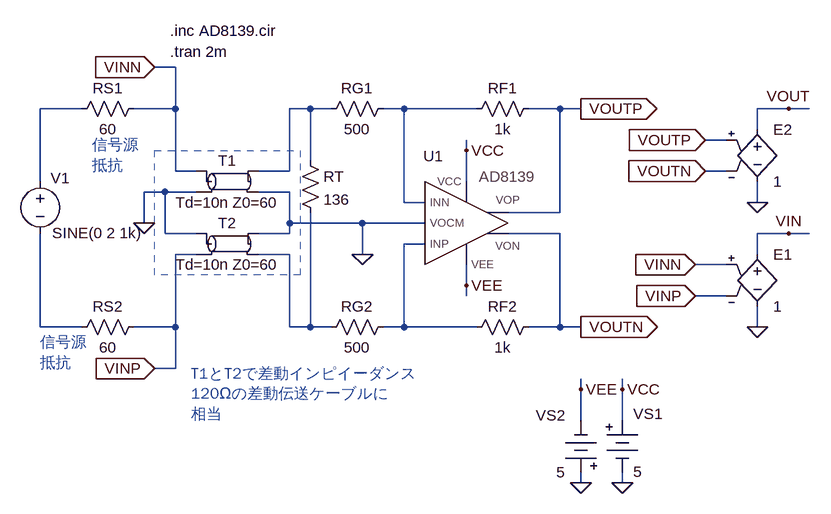
[diagram p0: schematic fig-02-05-16.asc]
fig-02-05-16.asc, the LTspice schematic file:
Version 4
SHEET 1 1332 680
WIRE -192 -192 -224 -192
WIRE -336 -128 -400 -128
WIRE -192 -128 -192 -192
WIRE -192 -128 -256 -128
WIRE 16 -128 -16 -128
WIRE 48 -128 16 -128
WIRE 160 -128 128 -128
WIRE 272 -128 160 -128
WIRE 400 -128 352 -128
WIRE 432 -128 400 -128
WIRE 752 -128 704 -128
WIRE 784 -128 752 -128
WIRE 704 -96 704 -128
WIRE 656 -80 624 -80
WIRE 256 -64 256 -80
WIRE 16 -48 16 -128
WIRE -192 -32 -192 -128
WIRE -160 -32 -192 -32
WIRE -16 -32 -16 -128
WIRE -16 -32 -64 -32
WIRE 656 -32 624 -32
WIRE -400 -16 -400 -128
WIRE 256 -16 256 -64
WIRE -208 0 -240 0
WIRE -160 0 -208 0
WIRE -16 0 -64 0
WIRE 160 16 160 -128
WIRE 192 16 160 16
WIRE 704 16 704 -16
WIRE 400 32 400 -128
WIRE 400 32 320 32
WIRE -240 48 -240 0
WIRE -16 48 -16 0
WIRE 96 48 -16 48
WIRE 192 48 96 48
WIRE -208 64 -208 0
WIRE -160 64 -208 64
WIRE -16 64 -16 48
WIRE -16 64 -64 64
WIRE 400 64 320 64
WIRE 752 64 704 64
WIRE 784 64 752 64
WIRE 192 80 160 80
WIRE -160 96 -192 96
WIRE -16 96 -64 96
WIRE 96 96 96 48
WIRE 704 96 704 64
WIRE 656 112 608 112
WIRE 256 144 256 112
WIRE 256 160 256 144
WIRE 656 160 608 160
WIRE -400 208 -400 64
WIRE -336 208 -400 208
WIRE -192 208 -192 96
WIRE -192 208 -256 208
WIRE -16 208 -16 96
WIRE 16 208 16 32
WIRE 16 208 -16 208
WIRE 48 208 16 208
WIRE 160 208 160 80
WIRE 160 208 128 208
WIRE 272 208 160 208
WIRE 400 208 400 64
WIRE 400 208 352 208
WIRE 432 208 400 208
WIRE 704 208 704 176
WIRE -192 272 -192 208
WIRE -192 272 -224 272
WIRE 432 304 432 288
WIRE 496 304 496 288
WIRE 432 352 432 304
WIRE 496 352 496 304
WIRE 432 448 432 432
WIRE 496 448 496 432
FLAG 432 -128 VOUTP
IOPIN 432 -128 Out
FLAG 96 96 0
FLAG 432 448 0
FLAG 496 448 0
FLAG 432 304 VEE
FLAG 496 304 VCC
FLAG 256 -64 VCC
FLAG 256 144 VEE
FLAG 432 208 VOUTN
IOPIN 432 208 Out
FLAG -224 -192 VINN
IOPIN -224 -192 In
FLAG -224 272 VINP
IOPIN -224 272 In
FLAG 704 16 0
FLAG 704 208 0
FLAG 608 160 VINP
IOPIN 608 160 In
FLAG 608 112 VINN
IOPIN 608 112 In
FLAG 624 -32 VOUTN
IOPIN 624 -32 In
FLAG 624 -80 VOUTP
IOPIN 624 -80 In
FLAG 752 64 VIN
FLAG 752 -128 VOUT
FLAG -240 48 0
SYMBOL res 368 -144 R90
WINDOW 0 0 56 VBottom 2
WINDOW 3 32 56 VTop 2
SYMATTR InstName RF1
SYMATTR Value 1k
SYMBOL res 144 -144 R90
WINDOW 0 0 56 VBottom 2
WINDOW 3 32 56 VTop 2
SYMATTR InstName RG1
SYMATTR Value 500
SYMBOL voltage -400 -32 R0
WINDOW 0 31 26 Bottom 2
WINDOW 3 87 111 Bottom 2
WINDOW 123 35 89 Top 2
WINDOW 39 0 0 Left 0
SYMATTR InstName V1
SYMATTR Value SINE(0 2 1k)
SYMBOL Misc\\battery 496 336 R0
WINDOW 0 17 6 Left 2
WINDOW 3 17 95 Left 2
WINDOW 123 0 0 Left 0
WINDOW 39 0 0 Left 0
SYMATTR InstName VS1
SYMATTR Value 5
SYMBOL Misc\\battery 432 448 R180
WINDOW 0 24 104 Left 2
WINDOW 3 24 16 Left 2
WINDOW 123 0 0 Left 0
WINDOW 39 0 0 Left 0
SYMATTR InstName VS2
SYMATTR Value 5
SYMBOL AD8139-sub 256 48 R0
WINDOW 0 -51 -88 Bottom 2
SYMATTR InstName U1
SYMATTR Value AD8139
SYMATTR Prefix X
SYMBOL res 368 192 R90
WINDOW 0 0 56 VBottom 2
WINDOW 3 32 56 VTop 2
SYMATTR InstName RF2
SYMATTR Value 1k
SYMBOL res 144 192 R90
WINDOW 0 0 56 VBottom 2
WINDOW 3 32 56 VTop 2
SYMATTR InstName RG2
SYMATTR Value 500
SYMBOL e 704 80 R0
SYMATTR InstName E1
SYMATTR Value 1
SYMBOL e 704 -112 R0
SYMATTR InstName E2
SYMATTR Value 1
SYMBOL res -240 -144 R90
WINDOW 0 0 56 VBottom 2
WINDOW 3 32 56 VTop 2
SYMATTR InstName RS1
SYMATTR Value 60
SYMBOL res -240 192 R90
WINDOW 0 0 56 VBottom 2
WINDOW 3 32 56 VTop 2
SYMATTR InstName RS2
SYMATTR Value 60
SYMBOL tline -112 -16 R0
SYMATTR InstName T1
SYMATTR Value Td=10n Z0=60
SYMBOL tline -112 80 R0
SYMATTR InstName T2
SYMATTR Value Td=10n Z0=60
SYMBOL res 0 -64 R0
SYMATTR InstName RT
SYMATTR Value 136
TEXT -200 -248 Left 2 !.inc AD8139.cir
TEXT -200 -216 Left 2 !.tran 2m
TEXT -168 280 Left 2 ;T1とT2で差動インピイーダンス\n120Ωの差動伝送ケーブルに\n相当
TEXT -320 -72 Left 2 ;信号源\n抵抗
TEXT -400 232 Left 2 ;信号源\n抵抗
RECTANGLE Normal 0 128 -224 -64 2

The netlist it stands for:
* fig-02-05-16.asc
RF1 VOUTP N003 1k
RG1 N003 N002 500
V1 N001 N006 SINE(0 2 1k)
VS1 VCC 0 5
VS2 0 VEE 5
XU1 N003 0 VCC VOUTP VOUTN VEE N004 AD8139-sub params: AD8139  ; pins INN VOCM VCC VOP VON VEE INP
RF2 VOUTN N004 1k
RG2 N004 N005 500
E1 VIN 0 VINN VINP 1
E2 VOUT 0 VOUTP VOUTN 1
RS1 VINN N001 60
RS2 VINP N006 60
T1 VINN 0 N002 0 Td=10n Z0=60
T2 0 VINP 0 N005 Td=10n Z0=60
RT N002 N005 136
.inc AD8139.cir
.tran 2m
* T1とT2で差動インピイーダンス
* 120Ωの差動伝送ケーブルに
* 相当
* 信号源
* 抵抗
* 信号源
* 抵抗
.backanno
.end